# EAGLE schematic main (EAGLE 4.11)
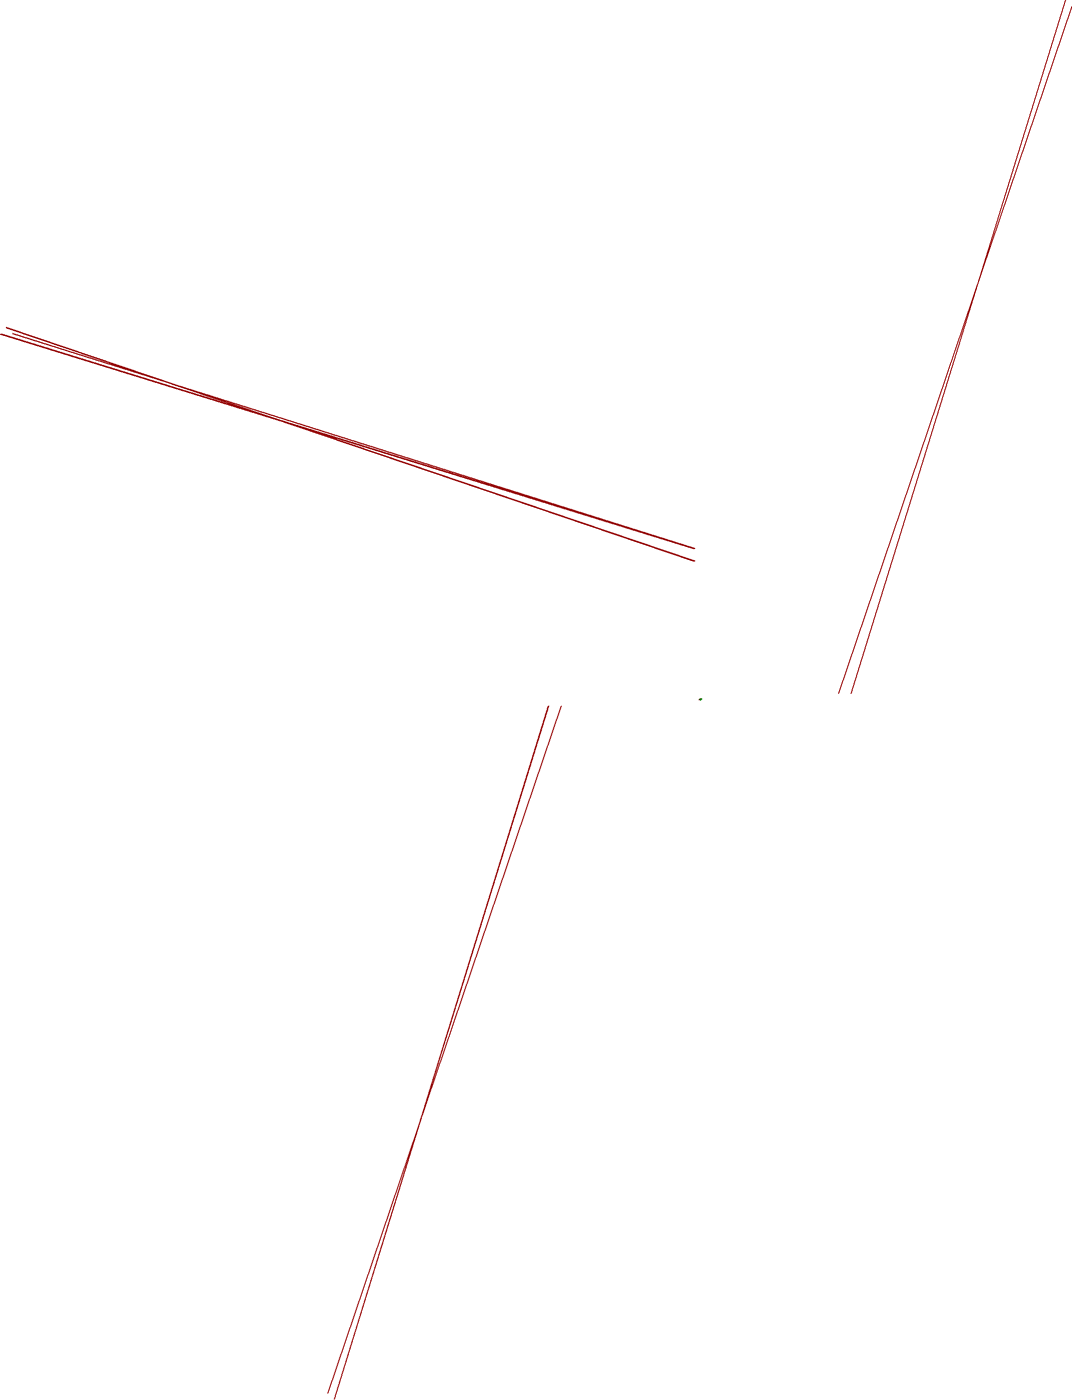
[diagram p0: schematic, sheet 1, overview]
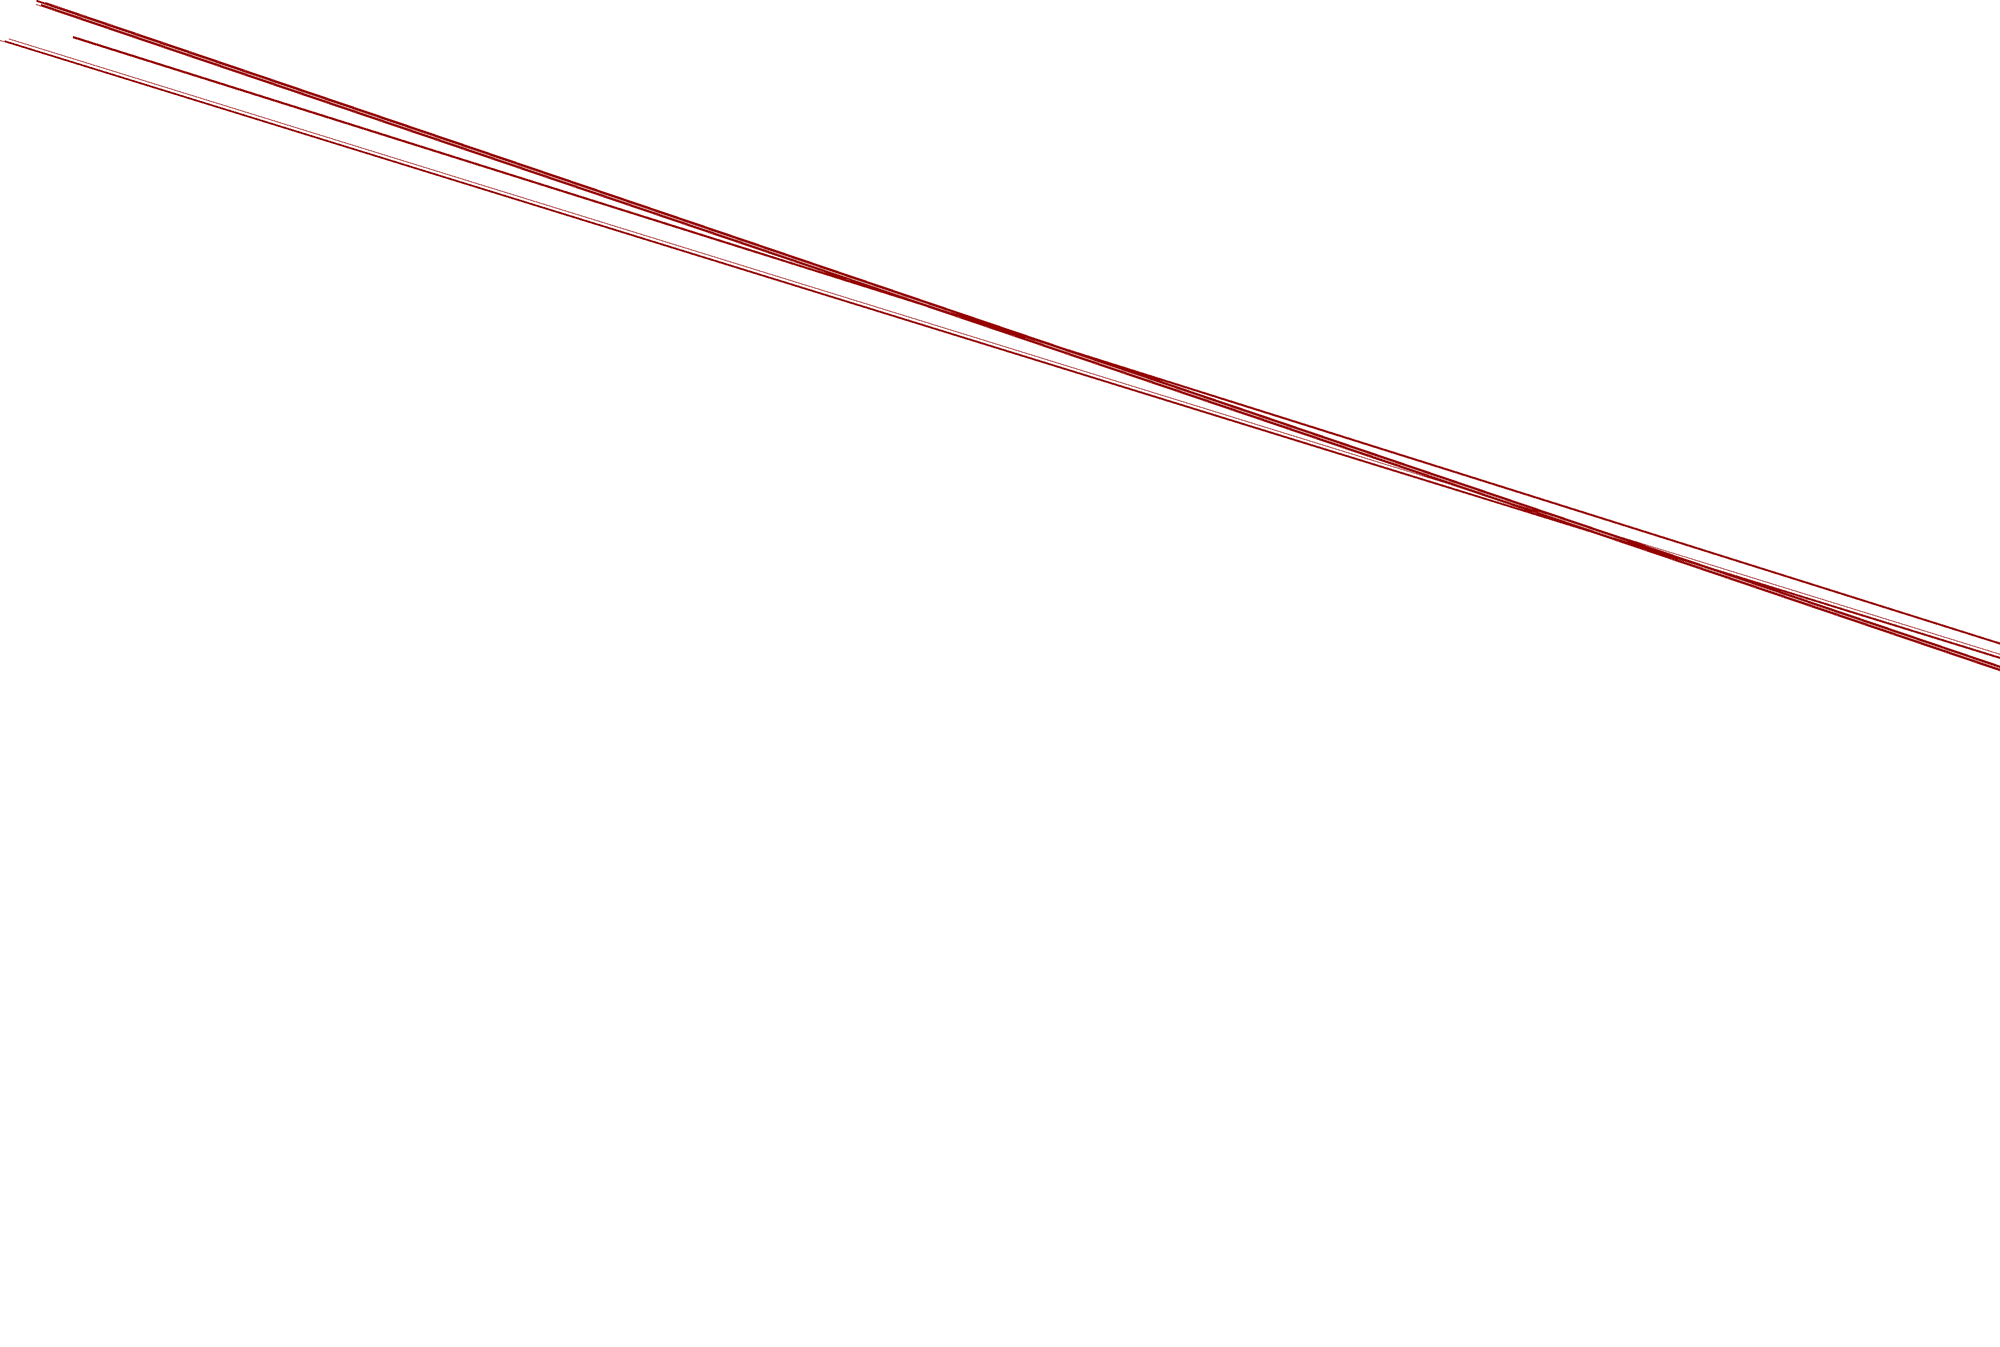
[diagram p1: schematic, sheet 1, part 1 of 8]
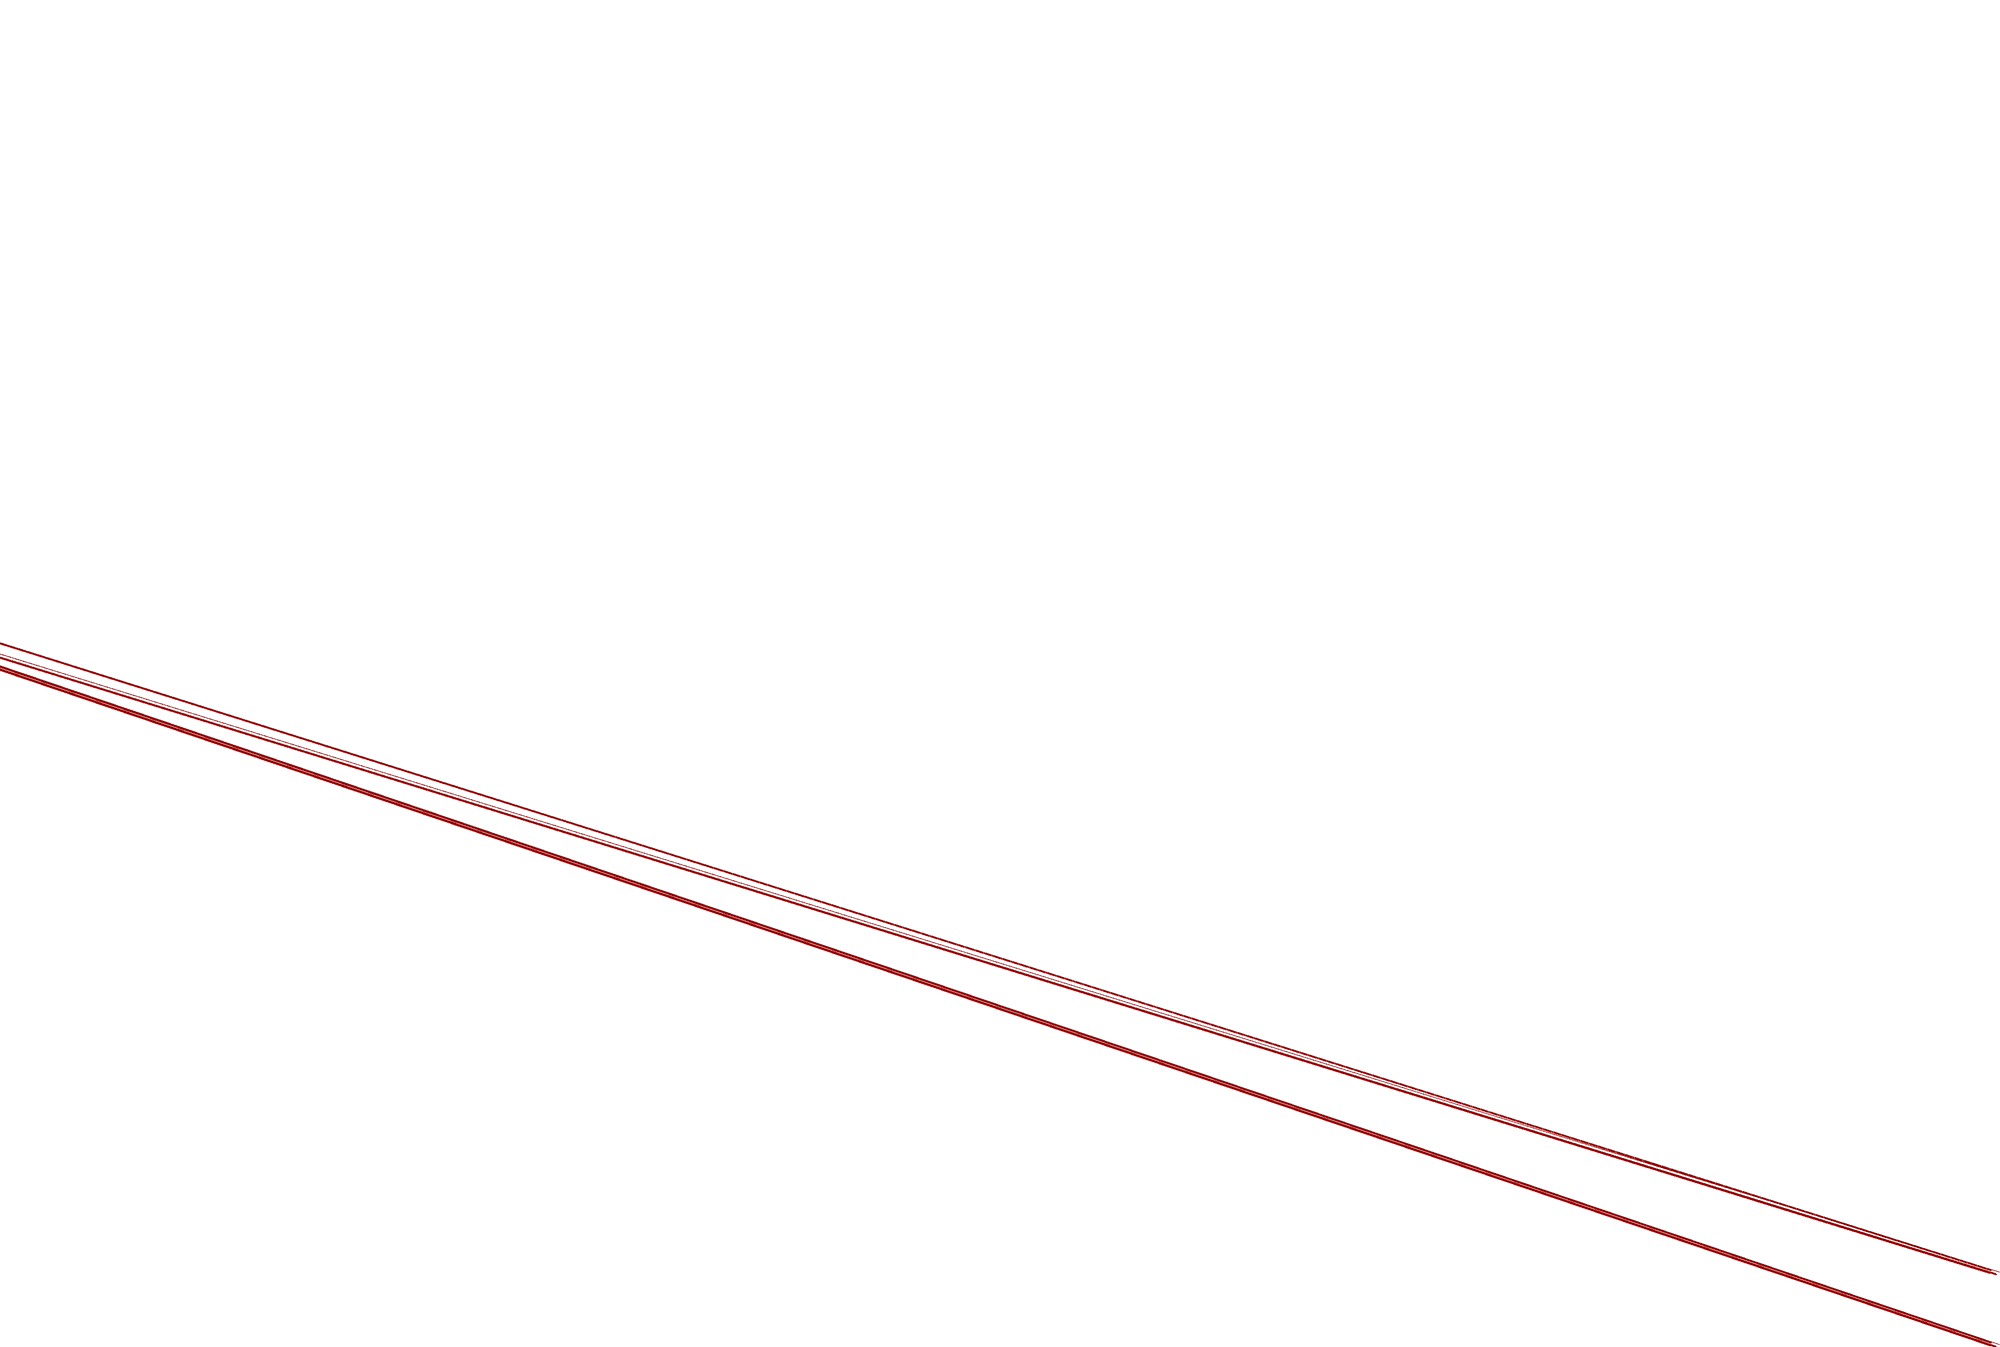
[diagram p2: schematic, sheet 1, part 2 of 8]
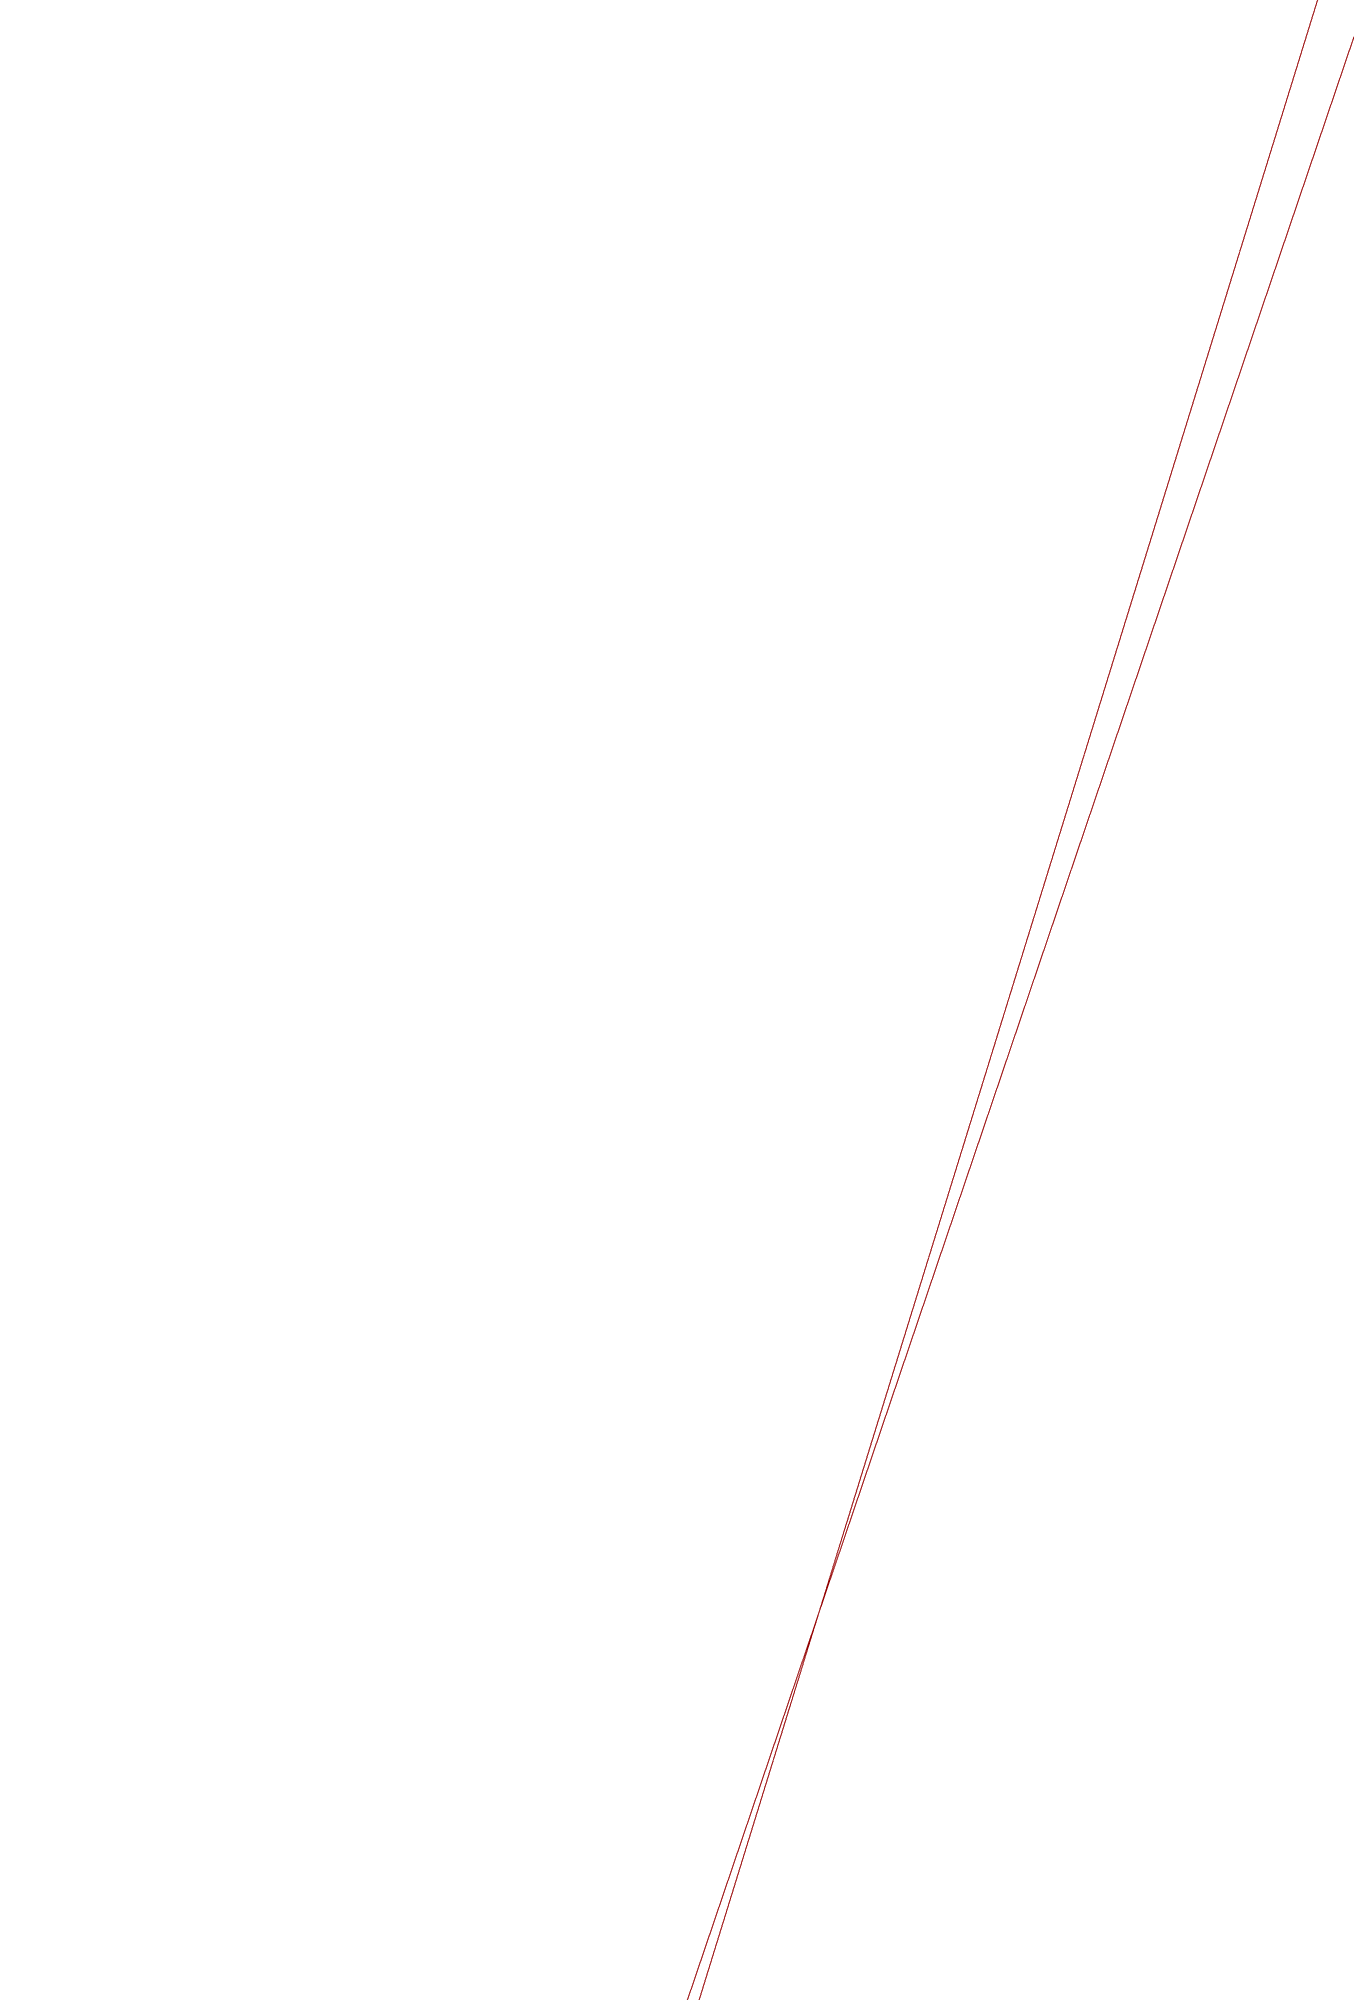
[diagram p3: schematic, sheet 1, part 3 of 8]
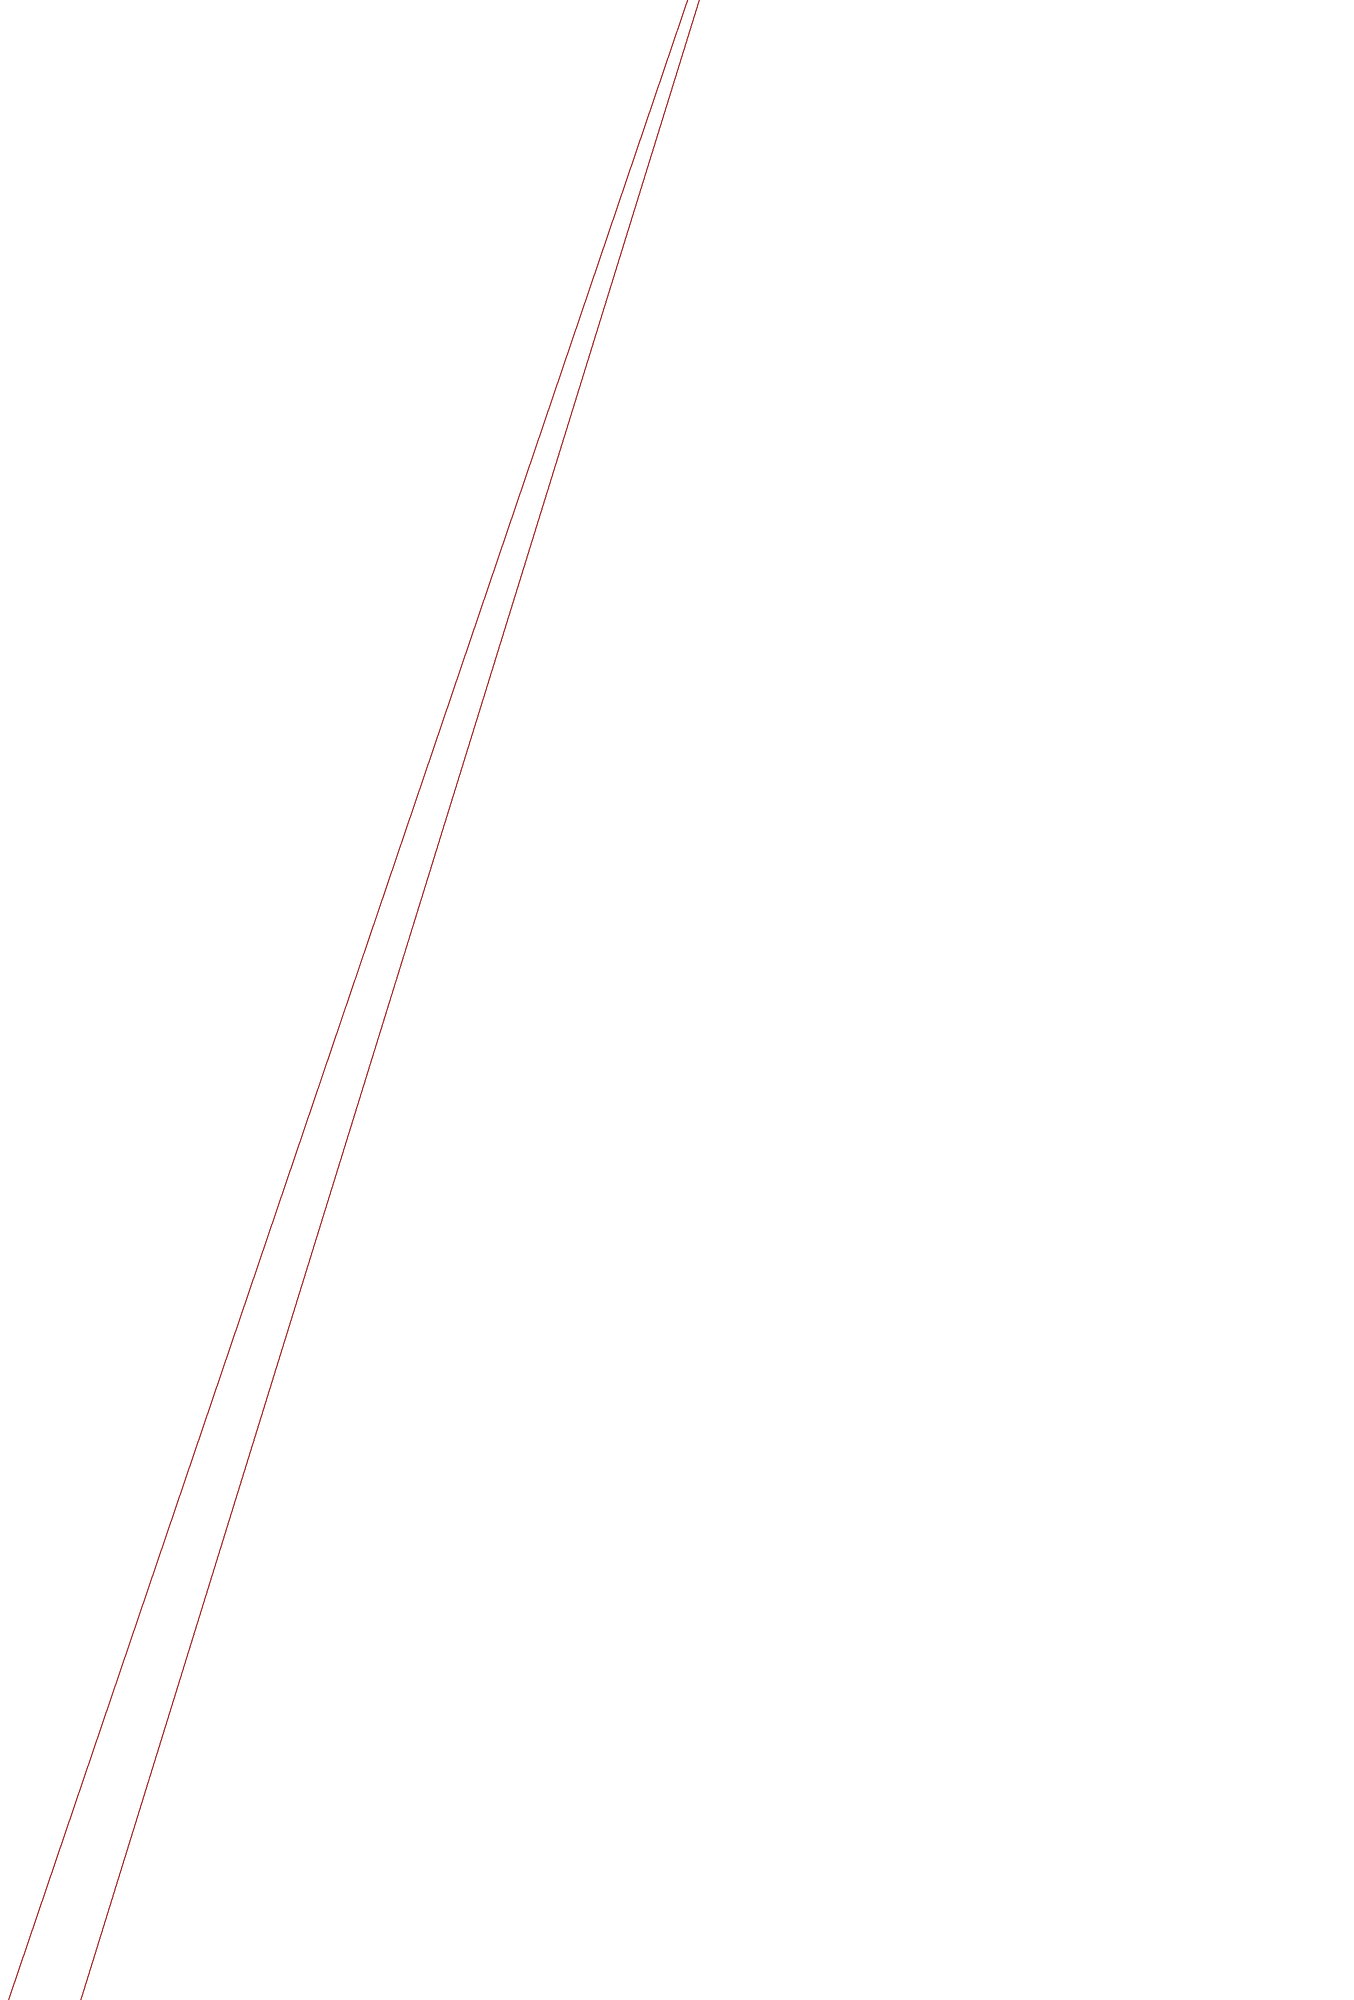
[diagram p4: schematic, sheet 1, part 4 of 8]
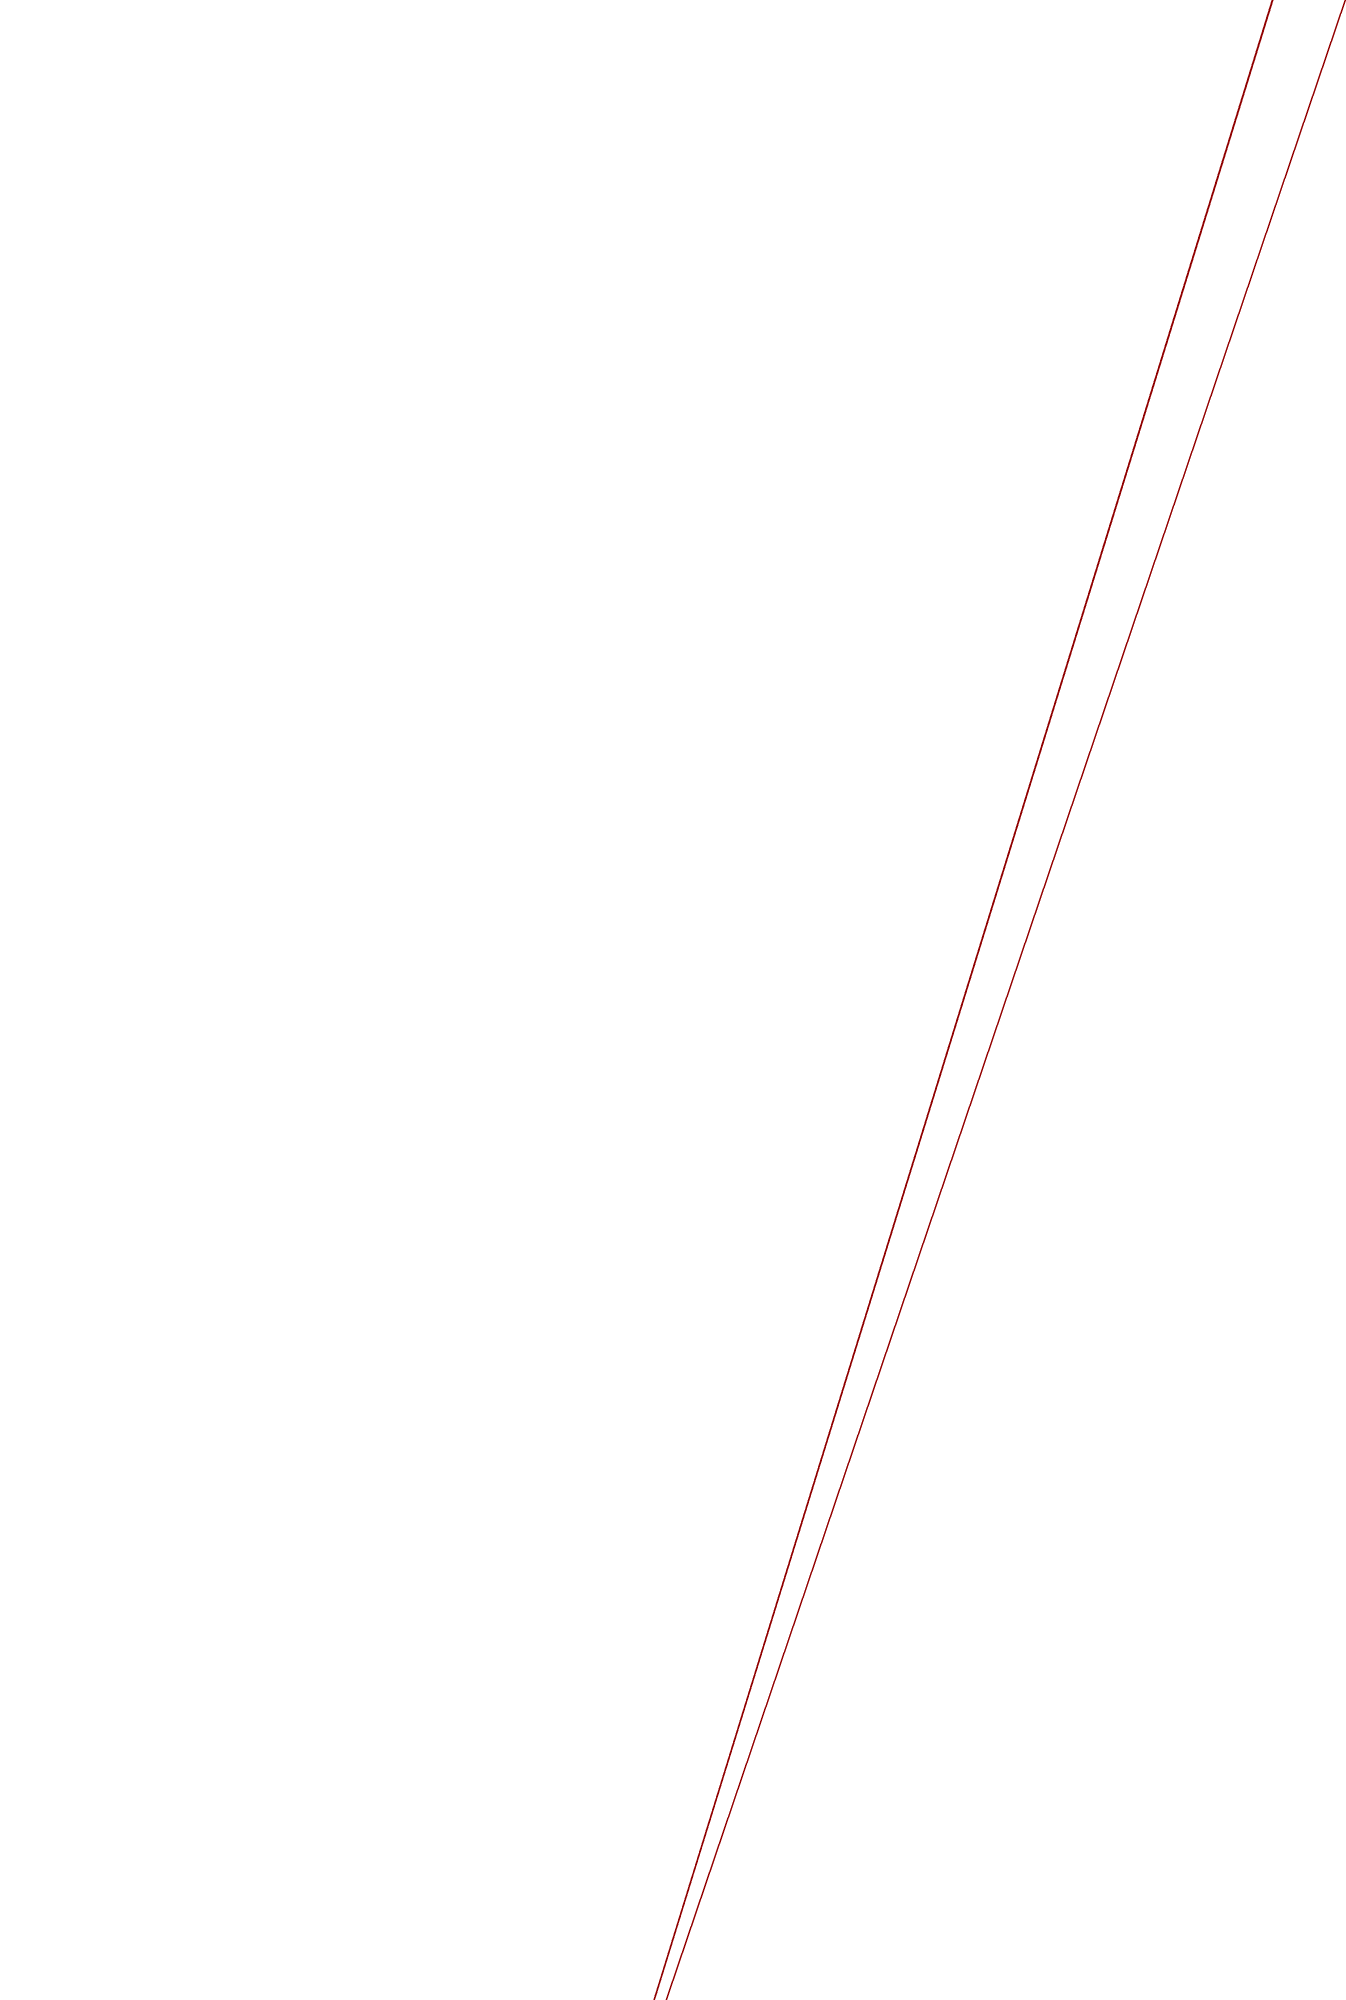
[diagram p5: schematic, sheet 1, part 5 of 8]
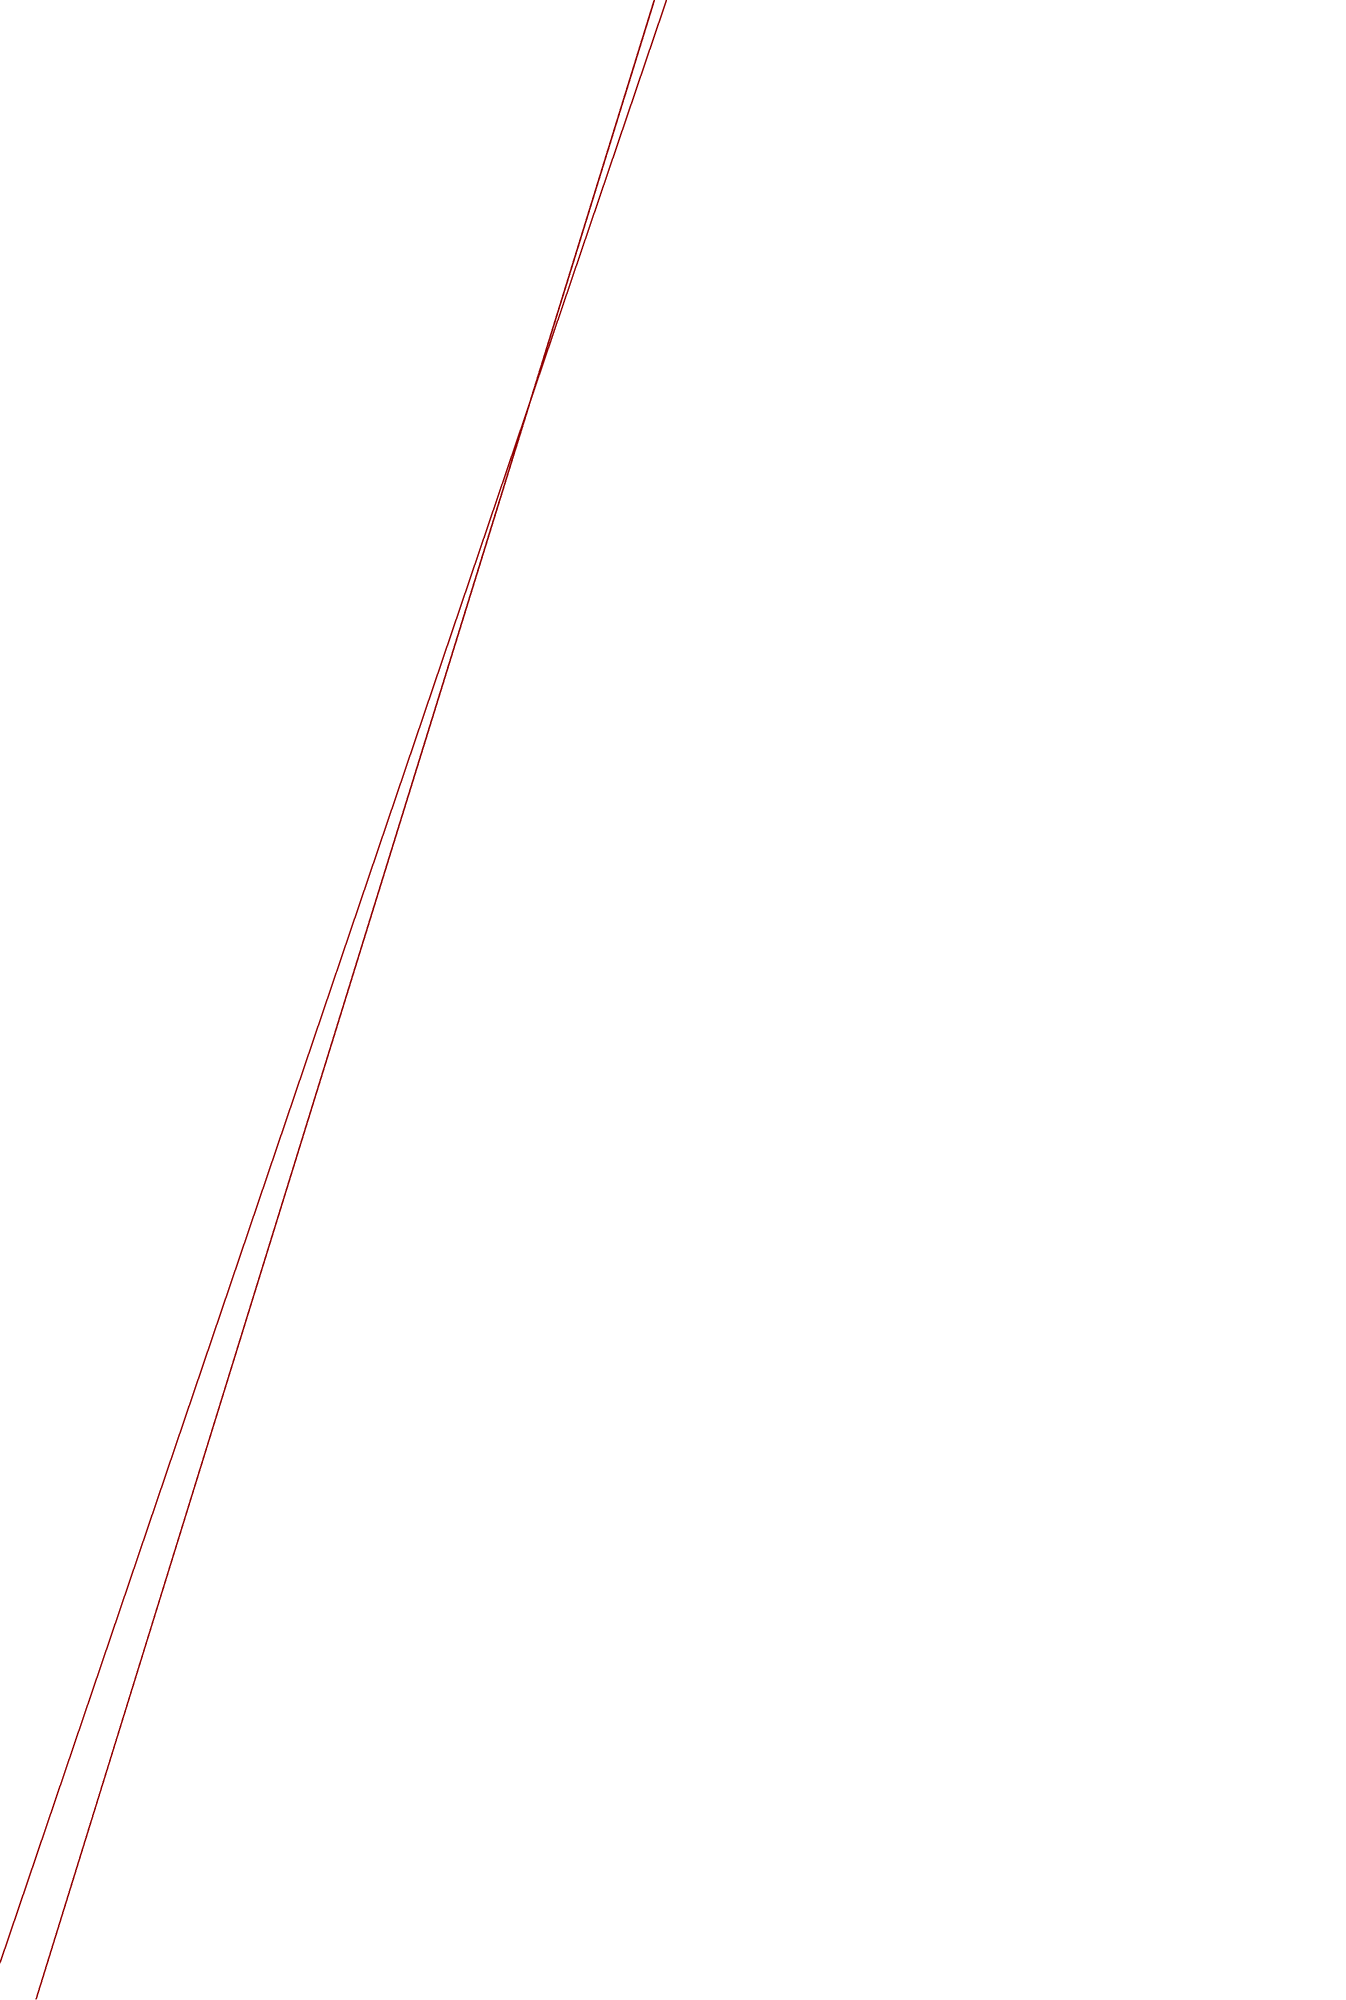
[diagram p6: schematic, sheet 1, part 6 of 8]
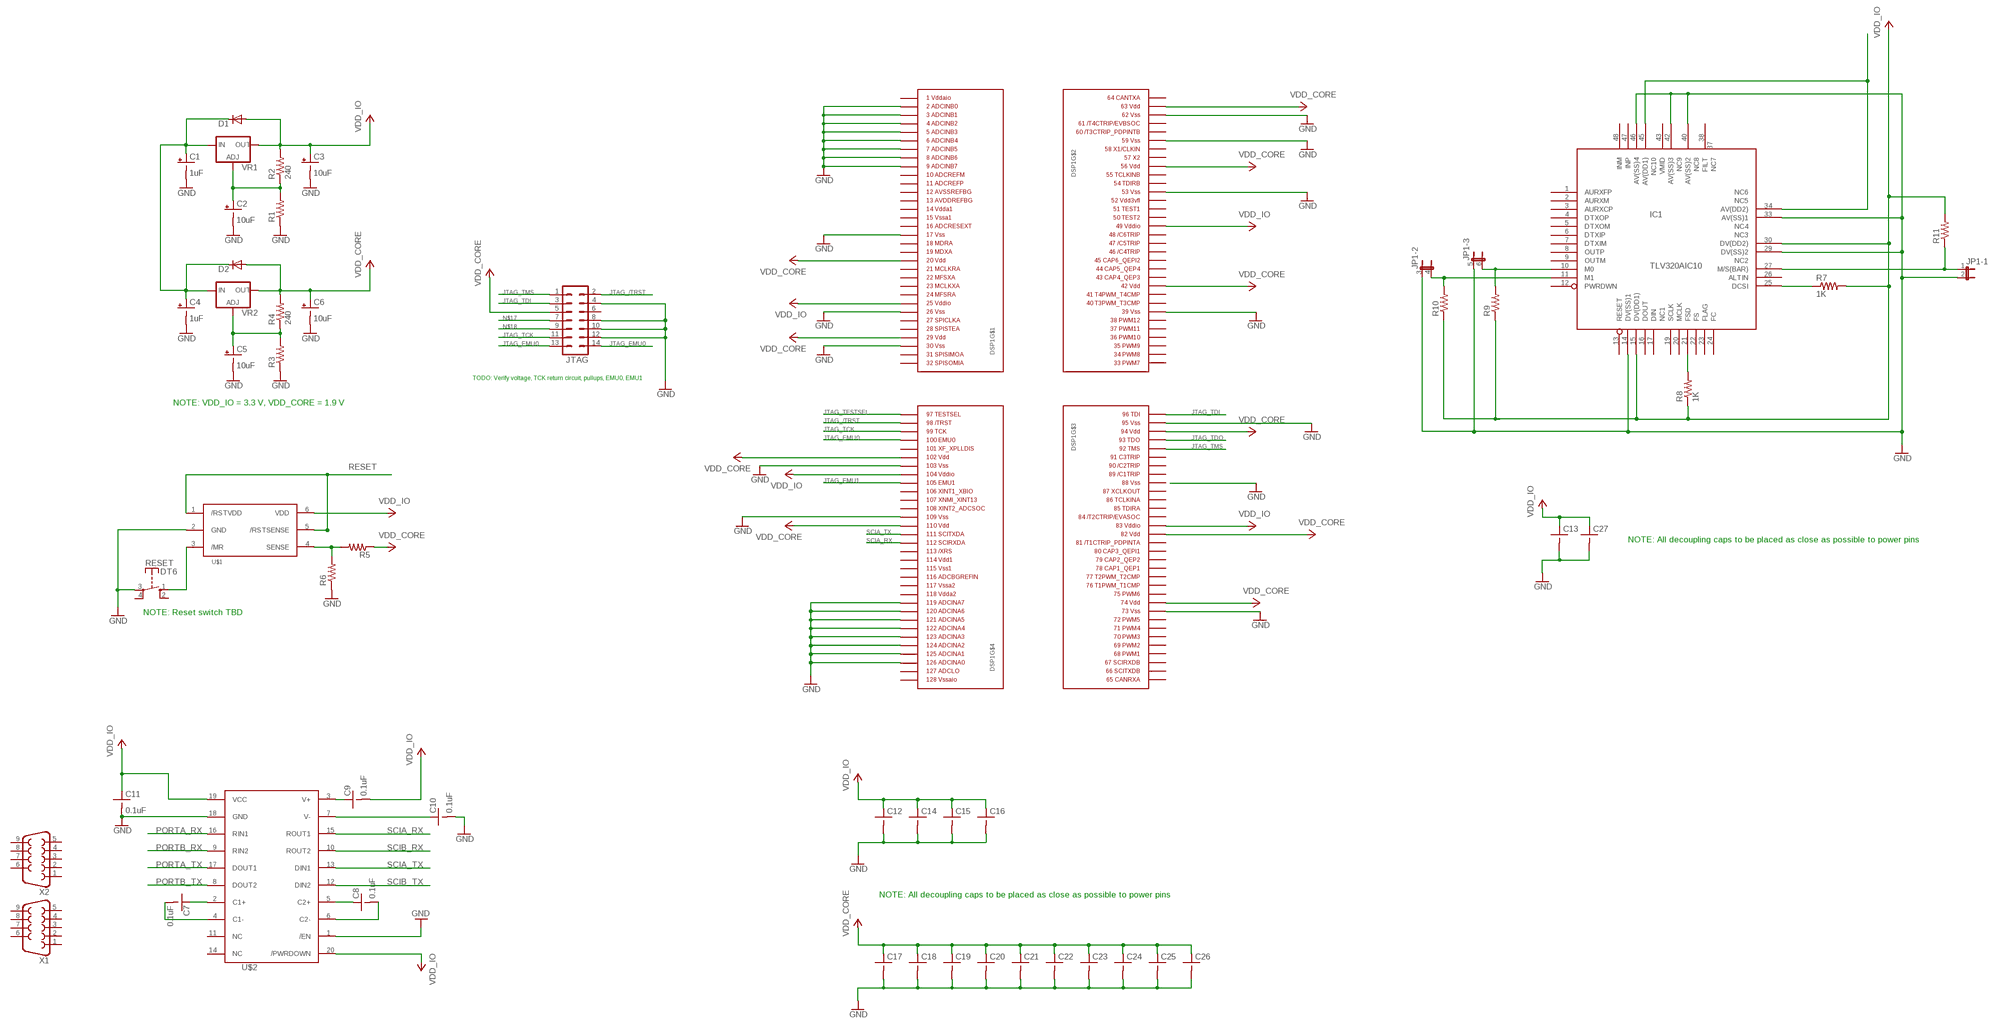
[diagram p7: schematic, sheet 1, part 7 of 8]
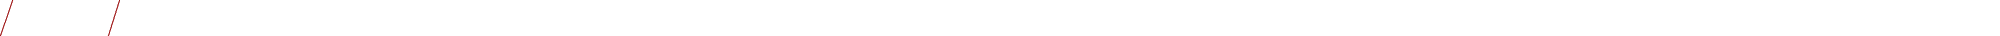
[diagram p8: schematic, sheet 1, part 8 of 8]

## Parts
C1  1uF  CPOL-USA/3216-18W  [A/3216-18W]
C2  10uF  CPOL-USA/3216-18W  [A/3216-18W]
C3  10uF  CPOL-USA/3216-18W  [A/3216-18W]
C4  1uF  CPOL-USA/3216-18W  [A/3216-18W]
C5  10uF  CPOL-USA/3216-18W  [A/3216-18W]
C6  10uF  CPOL-USA/3216-18W  [A/3216-18W]
C7  0.1uF  C-USC0402  [C0402]
C8  0.1uF  C-USC0402  [C0402]
C9  0.1uF  C-USC0402  [C0402]
C10  0.1uF  C-USC0402  [C0402]
C11  0.1uF  C-USC0402  [C0402]
C12  C-USC0603K  [C0603K]
C13  C-USC0603K  [C0603K]
C14  C-USC0603K  [C0603K]
C15  C-USC0603K  [C0603K]
C16  C-USC0603K  [C0603K]
C17  C-USC0603K  [C0603K]
C18  C-USC0603K  [C0603K]
C19  C-USC0603K  [C0603K]
C20  C-USC0603K  [C0603K]
C21  C-USC0603K  [C0603K]
C22  C-USC0603K  [C0603K]
C23  C-USC0603K  [C0603K]
C24  C-USC0603K  [C0603K]
C25  C-USC0603K  [C0603K]
C26  C-USC0603K  [C0603K]
C27  C-USC0603K  [C0603K]
D1  DIODE-DO214BA  [DO-214BA]
D2  DIODE-DO214BA  [DO-214BA]
DSP1  TMS3202810  [PQFPG128]
IC1  TLV320AIC10  [PQFP48]
JP1  JP3QE  [JP3Q]
JTAG  ML14  [ML14]
R1  R-US_R0603  [R0603]
R2  240  R-US_R0603  [R0603]
R3  R-US_R0603  [R0603]
R4  240  R-US_R0603  [R0603]
R5  R-US_R0603  [R0603]
R6  R-US_R0603  [R0603]
R7  1K  R-US_R0603  [R0603]
R8  1K  R-US_R0603  [R0603]
R9  R-US_R0603  [R0603]
R10  R-US_R0603  [R0603]
R11  R-US_R0603  [R0603]
RESET  DT6  [DT6]
U$1  TPS3106  [SOP06]
U$2  MAX3222SO20W  [SO20W]
VR1  LM317TL  [317TL]
VR2  LM317TL  [317TL]
X1  F09H  [F09H]
X2  F09H  [F09H]

## Nets
FILL: R5.2 R6.2 U$1.4(SENSE)
GND: C1.- C2.- C3.- C4.- C5.- C6.- C10.2 C11.2 C12.2 C13.2 C14.2 C15.2 C16.2 C17.2 C18.2 C19.2 C20.2 C21.2 C22.2 C23.2 C24.2 C25.2 C26.2 C27.2 DSP1.P$2 DSP1.P$3 DSP1.P$4 DSP1.P$5 DSP1.P$6 DSP1.P$7 DSP1.P$8 DSP1.P$9 DSP1.P$17 DSP1.P$26 DSP1.P$30 DSP1.P$39 DSP1.P$53 DSP1.P$59 DSP1.P$62 DSP1.P$73 DSP1.P$95 DSP1.P$103 DSP1.P$109 DSP1.P$119 DSP1.P$120 DSP1.P$121 DSP1.P$122 DSP1.P$123 DSP1.P$124 DSP1.P$125 DSP1.P$126 IC1.14(DV(SS)1) IC1.29(DV(SS)2) IC1.33(AV(SS)1) IC1.40(AV(SS)2) IC1.42(AV(SS)3) IC1.46(AV(SS)4) JP1.2 JP1.3 JP1.5 JTAG.4 JTAG.8 JTAG.10 JTAG.12 R1.1 R3.1 R6.1 RESET.3(P) U$1.2(GND) U$2.1(/EN) U$2.18(GND)
JTAG_/TRST: DSP1.P$98 JTAG.2
JTAG_EMU0: DSP1.P$100 JTAG.13 JTAG.14
JTAG_EMU1: DSP1.P$105
JTAG_TCK: DSP1.P$99 JTAG.11
JTAG_TDI: DSP1.P$96 JTAG.3
JTAG_TDO: DSP1.P$93
JTAG_TESTSEL: DSP1.P$97
JTAG_TMS: DSP1.P$92 JTAG.1
N$1: C1.+ C4.+ D1.C D2.C VR1.3(IN) VR2.3(IN)
N$2: C5.+ R3.2 R4.1 VR2.1(ADJ)
N$3: C7.1 U$2.2(C1+)
N$4: C2.+ R1.2 R2.1 VR1.1(ADJ)
N$5: IC1.34(AV(DD2)) IC1.45(AV(DD1))
N$6: IC1.25(DCSI) R7.1
N$7: RESET.1(S) U$1.3(/MR)
N$8: C7.2 U$2.4(C1-)
N$9: C8.1 U$2.5(C2+)
N$10: C8.2 U$2.6(C2-)
N$11: C9.1 U$2.3(V+)
N$12: C10.1 U$2.7(V-)
N$13: IC1.10(M0) JP1.6 R9.2
N$14: IC1.21(FSD) R8.2
N$15: IC1.11(M1) JP1.4 R10.2
N$16: IC1.27(M/S(BAR)) JP1.1 R11.1
N$17: JTAG.7
N$18: JTAG.9
PORTA_RX: U$2.16(RIN1)
PORTA_TX: U$2.17(DOUT1)
PORTB_RX: U$2.9(RIN2)
PORTB_TX: U$2.8(DOUT2)
RESET: U$1.1(/RSTVDD) U$1.5(/RSTSENSE)
SCIA_RX: DSP1.P$112 U$2.15(ROUT1)
SCIA_TX: DSP1.P$111 U$2.13(DIN1)
SCIB_RX: U$2.10(ROUT2)
SCIB_TX: U$2.12(DIN2)
VDD_CORE: C6.+ C17.1 C18.1 C19.1 C20.1 C21.1 C22.1 C23.1 C24.1 C25.1 C26.1 D2.A DSP1.P$20 DSP1.P$29 DSP1.P$42 DSP1.P$56 DSP1.P$63 DSP1.P$74 DSP1.P$82 DSP1.P$94 DSP1.P$102 DSP1.P$110 JTAG.5 R4.2 R5.1 VR2.2(OUT)
VDD_IO: C3.+ C9.2 C11.1 C12.1 C13.1 C14.1 C15.1 C16.1 C27.1 D1.A DSP1.P$25 DSP1.P$49 DSP1.P$83 DSP1.P$104 IC1.15(DV(DD1)) IC1.30(DV(DD2)) R2.2 R7.2 R8.1 R9.1 R10.1 R11.2 U$1.6(VDD) U$2.19(VCC) U$2.20(/PWRDOWN) VR1.2(OUT)
Unconnected: DSP1.P$1 DSP1.P$10 DSP1.P$11 DSP1.P$12 DSP1.P$13 DSP1.P$14 DSP1.P$15 DSP1.P$16 DSP1.P$18 DSP1.P$19 DSP1.P$21 DSP1.P$22 DSP1.P$23 DSP1.P$24 DSP1.P$27 DSP1.P$28 DSP1.P$31 DSP1.P$32 DSP1.P$33 DSP1.P$34 DSP1.P$35 DSP1.P$36 DSP1.P$37 DSP1.P$38 DSP1.P$40 DSP1.P$41 DSP1.P$43 DSP1.P$44 DSP1.P$45 DSP1.P$46 DSP1.P$47 DSP1.P$48 DSP1.P$50 DSP1.P$51 DSP1.P$52 DSP1.P$54 DSP1.P$55 DSP1.P$57 DSP1.P$58 DSP1.P$60 DSP1.P$61 DSP1.P$64 DSP1.P$65 DSP1.P$66 DSP1.P$67 DSP1.P$68 DSP1.P$69 DSP1.P$70 DSP1.P$71 DSP1.P$72 DSP1.P$75 DSP1.P$76 DSP1.P$77 DSP1.P$78 DSP1.P$79 DSP1.P$80 DSP1.P$81 DSP1.P$84 DSP1.P$85 DSP1.P$86 DSP1.P$87 DSP1.P$88 DSP1.P$89 DSP1.P$90 DSP1.P$91 DSP1.P$101 DSP1.P$106 DSP1.P$107 DSP1.P$108 DSP1.P$113 DSP1.P$114 DSP1.P$115 DSP1.P$116 DSP1.P$117 DSP1.P$118 DSP1.P$127 DSP1.P$128 IC1.1(AURXFP) IC1.2(AURXM) IC1.3(AURXCP) IC1.4(DTXOP) IC1.5(DTXOM) IC1.6(DTXIP) IC1.7(DTXIM) IC1.8(OUTP) IC1.9(OUTM) IC1.12(PWRDWN) IC1.13(RESET) IC1.16(DOUT) IC1.17(DIN) IC1.18(NC1) IC1.19(SCLK) IC1.20(MCLK) IC1.22(FS) IC1.23(FLAG) IC1.24(FC) IC1.26(ALTIN) IC1.28(NC2) IC1.31(NC3) IC1.32(NC4) IC1.35(NC5) IC1.36(NC6) IC1.37(NC7) IC1.38(FILT) IC1.39(NC8) IC1.41(NC9) IC1.43(VMID) IC1.44(NC10) IC1.47(INP) IC1.48(INM) JTAG.6 RESET.2(S) RESET.4(P) U$2.11(NC) U$2.14(NC) X1.1 X1.2 X1.3 X1.4 X1.5 X1.6 X1.7 X1.8 X1.9 X2.1 X2.2 X2.3 X2.4 X2.5 X2.6 X2.7 X2.8 X2.9

## Notes on the sheet
- TODO: Verify voltage, TCK return circuit, pullups, EMU0, EMU1
- NOTE: VDD_IO = 3.3 V, VDD_CORE = 1.9 V
- NOTE: All decoupling caps to be placed as close as possible to power pins
- NOTE: Reset switch TBD
- NOTE: All decoupling caps to be placed as close as possible to power pins

## Library data of the parts
C1-C6 = rcl:CPOL-US: POLARIZED CAPACITOR, American symbol
C7-C27 = rcl:C-US: CAPACITOR, American symbol
D1 D2 = diode:DIODE-: DIODE
DSP1 = camillo_parts:TMS3202810: TMS3202810 - Digital Signal Processor
IC1 = camillo_parts:TLV320AIC10: TLV320AIC10 - 22ksps Audio Codec
JP1 = jumper:JP3QE: JUMPER
JTAG = con-ml:ML14: HARTING
R1-R11 = rcl:R-US_: RESISTOR, American symbol
RESET = switch-misc:DT: ITT SWITCH
U$1 = camillo_parts:TPS3106: TPS3106 - ULTRALOW SUPPLY-CURRENT/SUPPLY-VOLTAGE SUPERVISORY CIRCUIT
U$2 = camillo_parts:MAX3222: MAX3222 - 3-V to 5.5-V Multichannel RS-232 Line Driver/Receiver
VR1 VR2 = v-reg:LM317TL: VOLTAGE REGULATOR
X1 X2 = con-subd:F09: SUB-D